# EasyEDA Pro project zhuban.epro, schematic Schematic1

## Sheets
1 P1: Board Name: Board1; Create Date: 2025-02-24; Page Name: P1; Project Name: as2月底版; Schematic Name: Schematic1; Update Date: 2025-02-25; Company: 嘉立创EDA; Page Size: A4; Version: V1.0
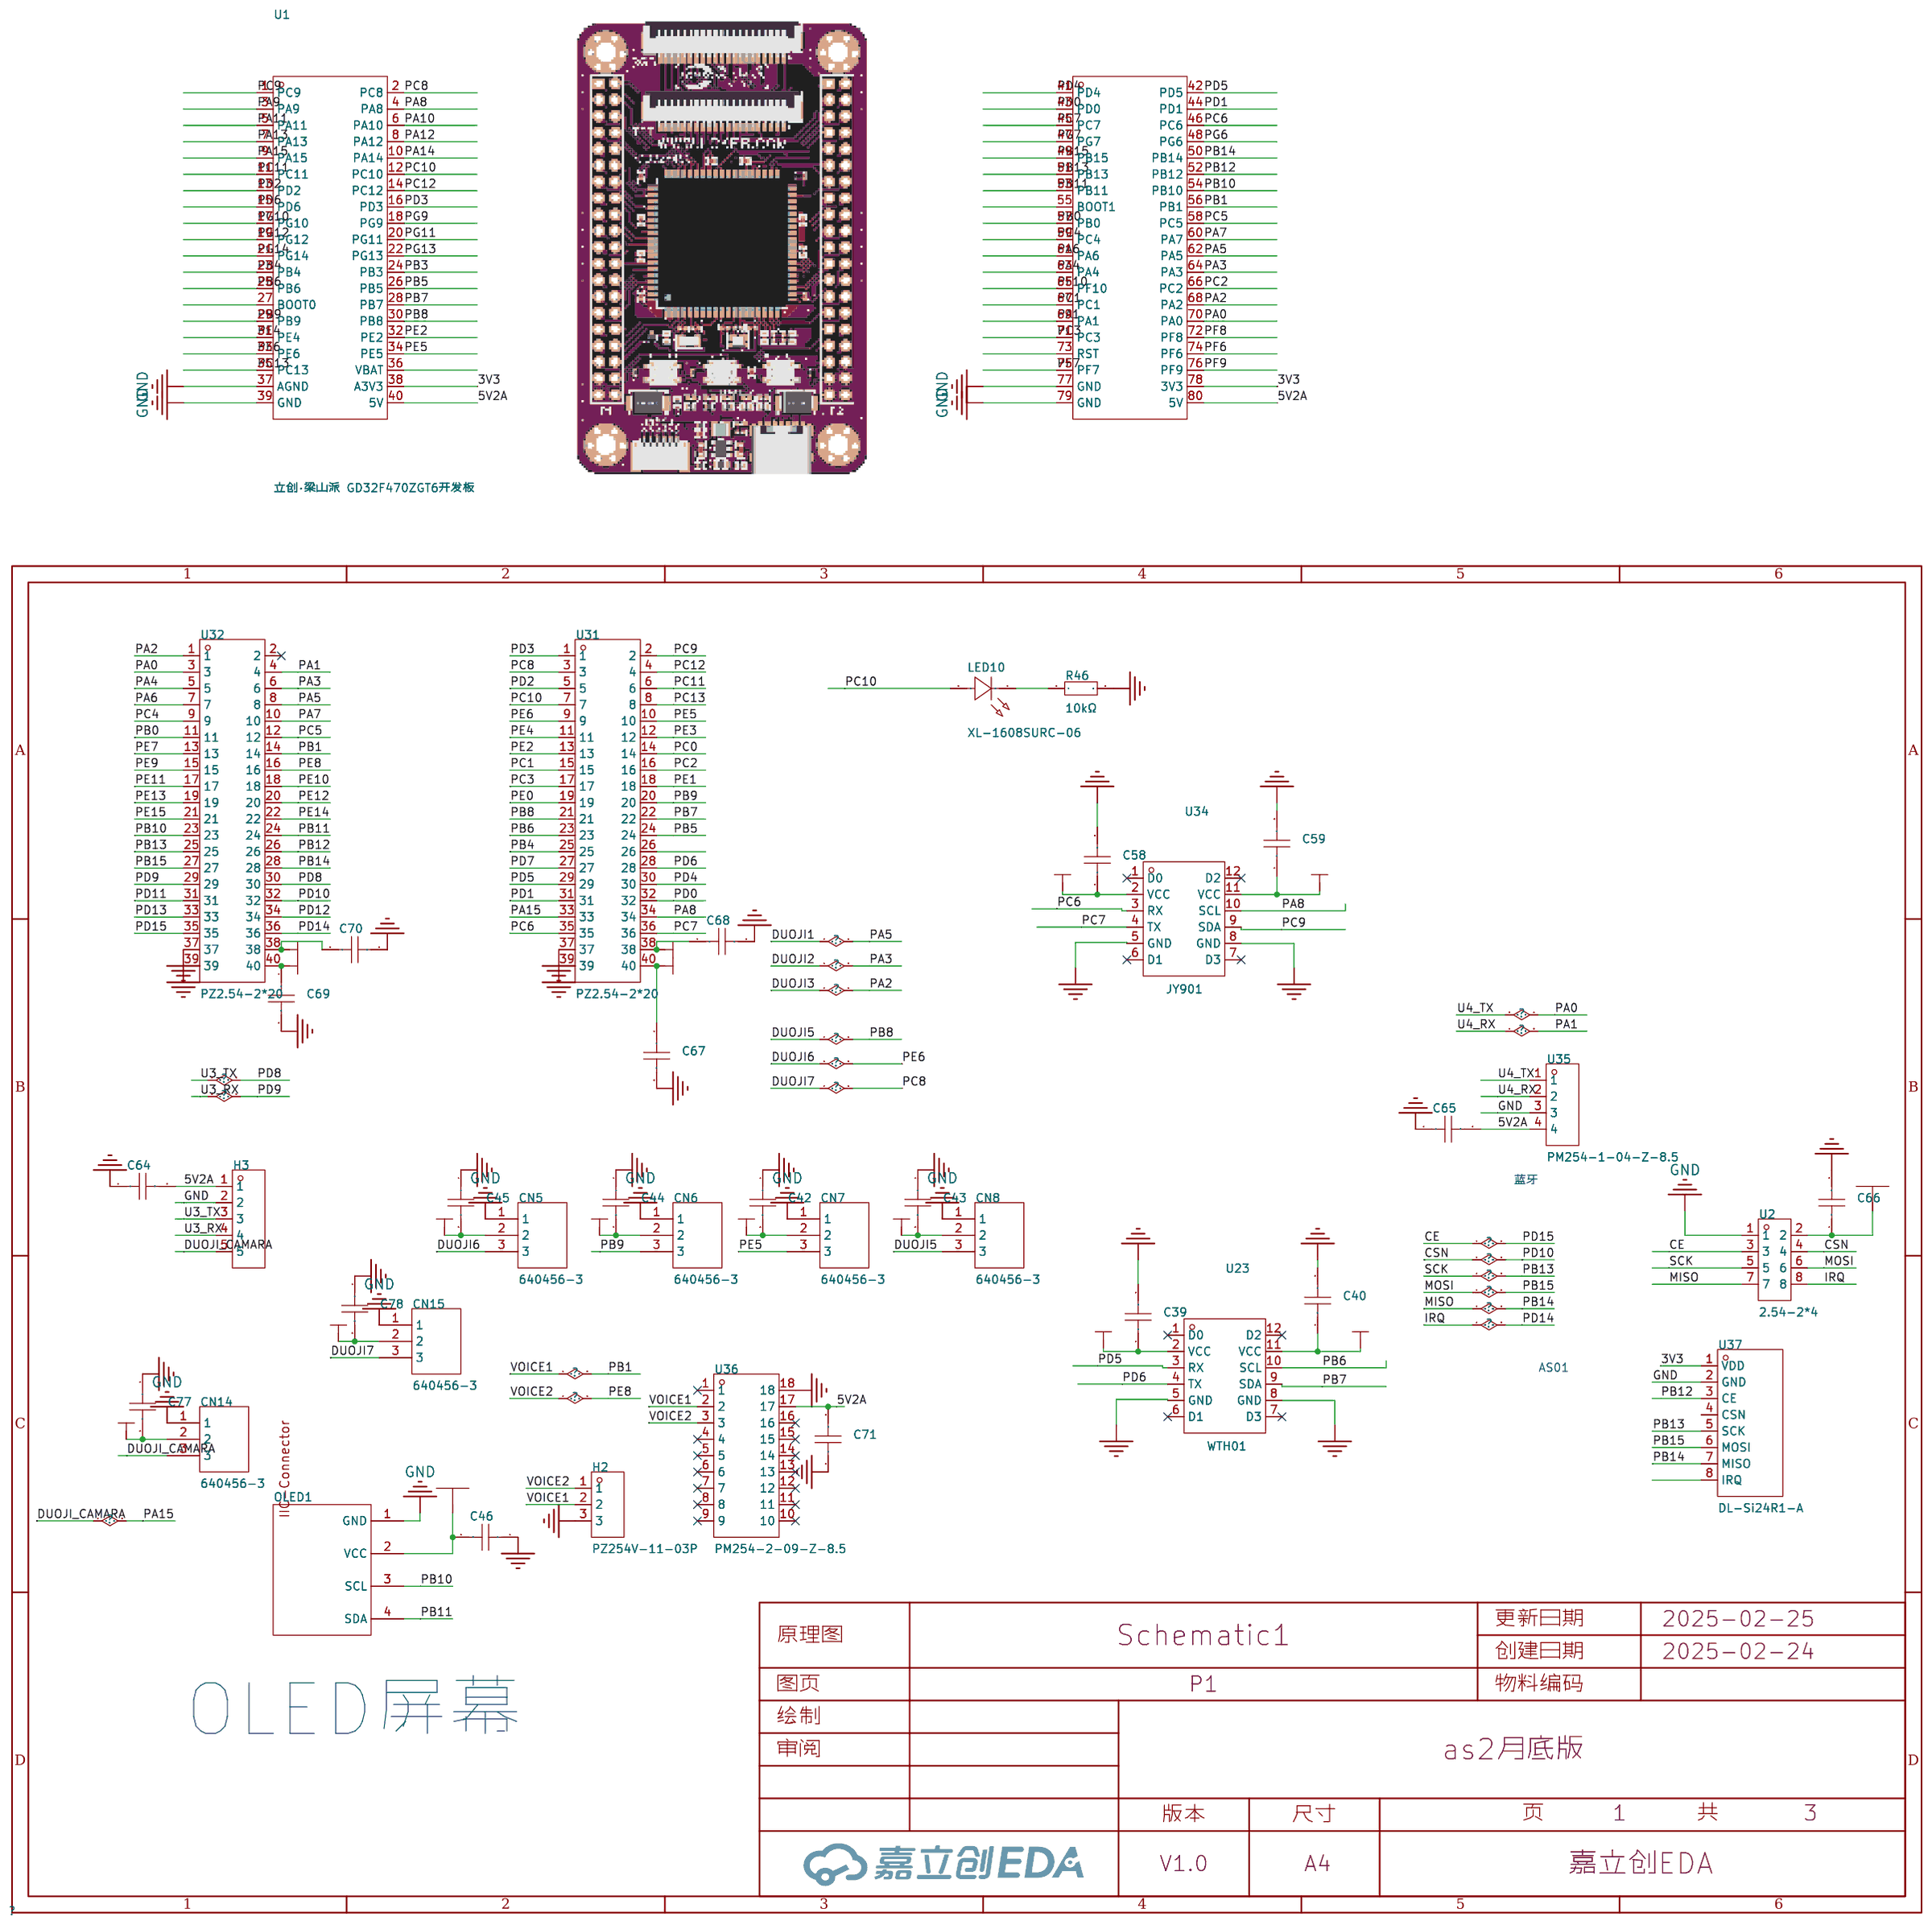
[diagram p0: P1]
2 P2: Page Name: P2; Update Date: 2025-02-24
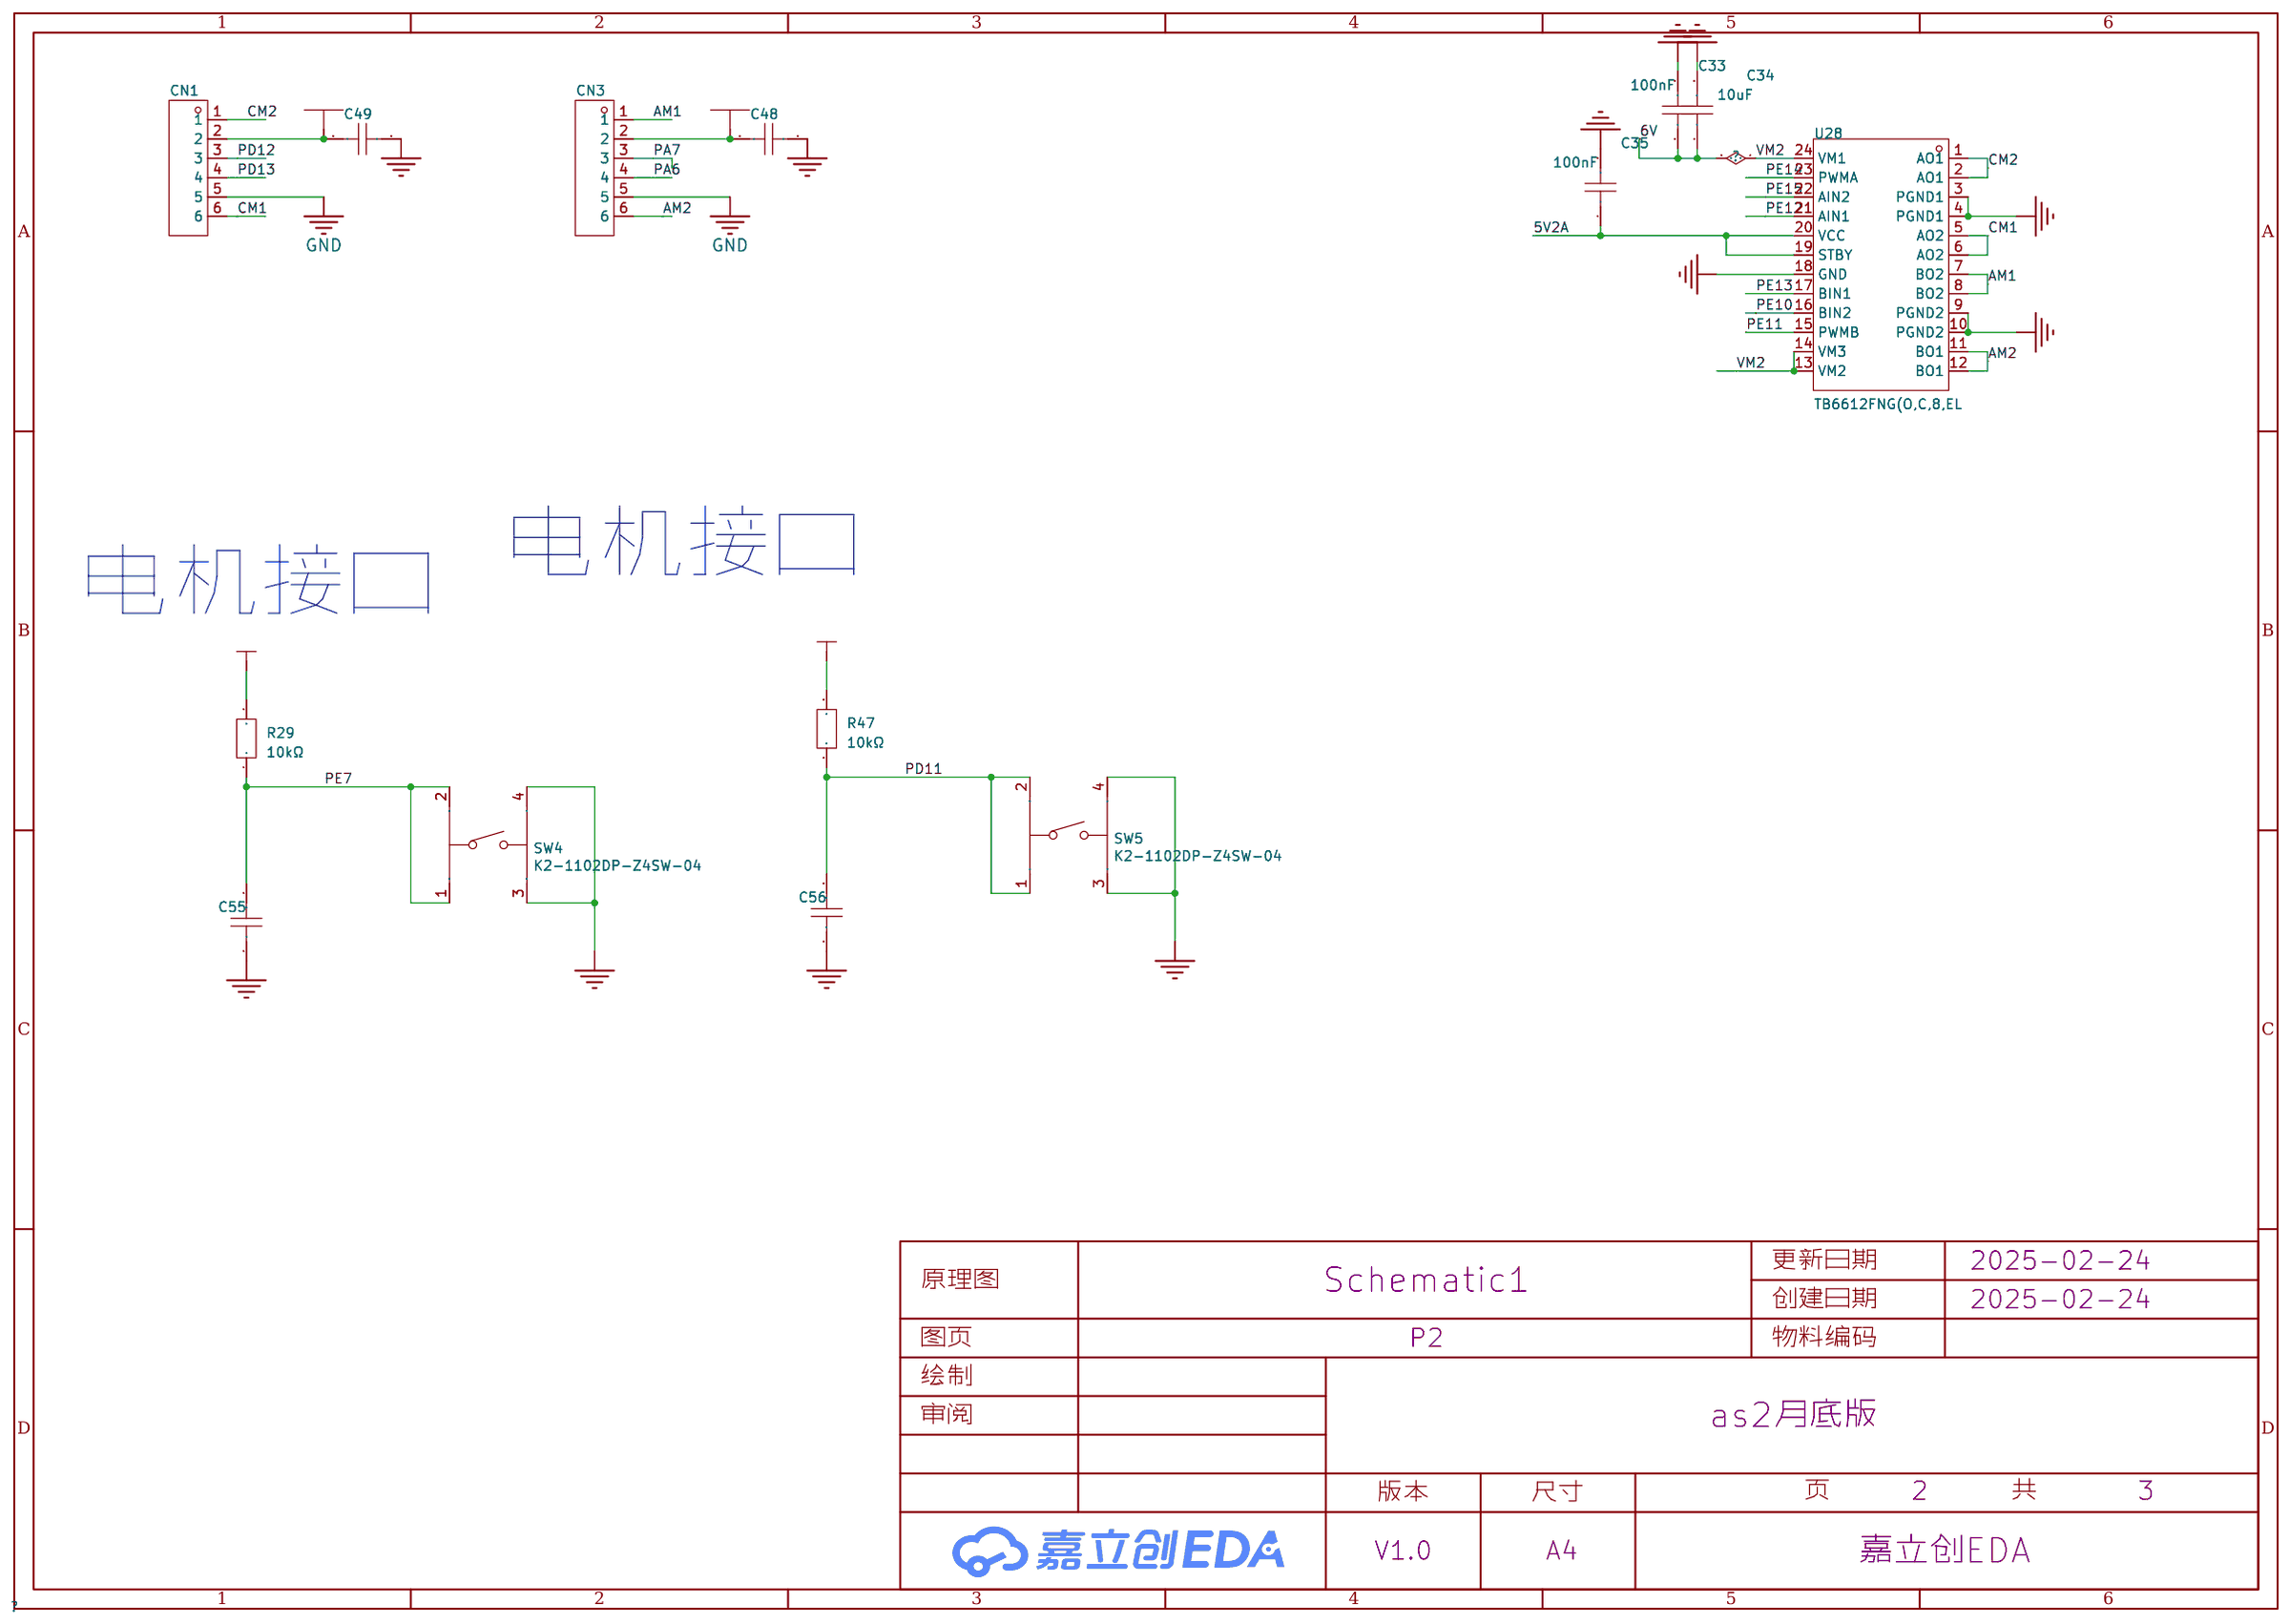
[diagram p1: P2]
3 P3: Page Name: P3; Update Date: 2025-02-24
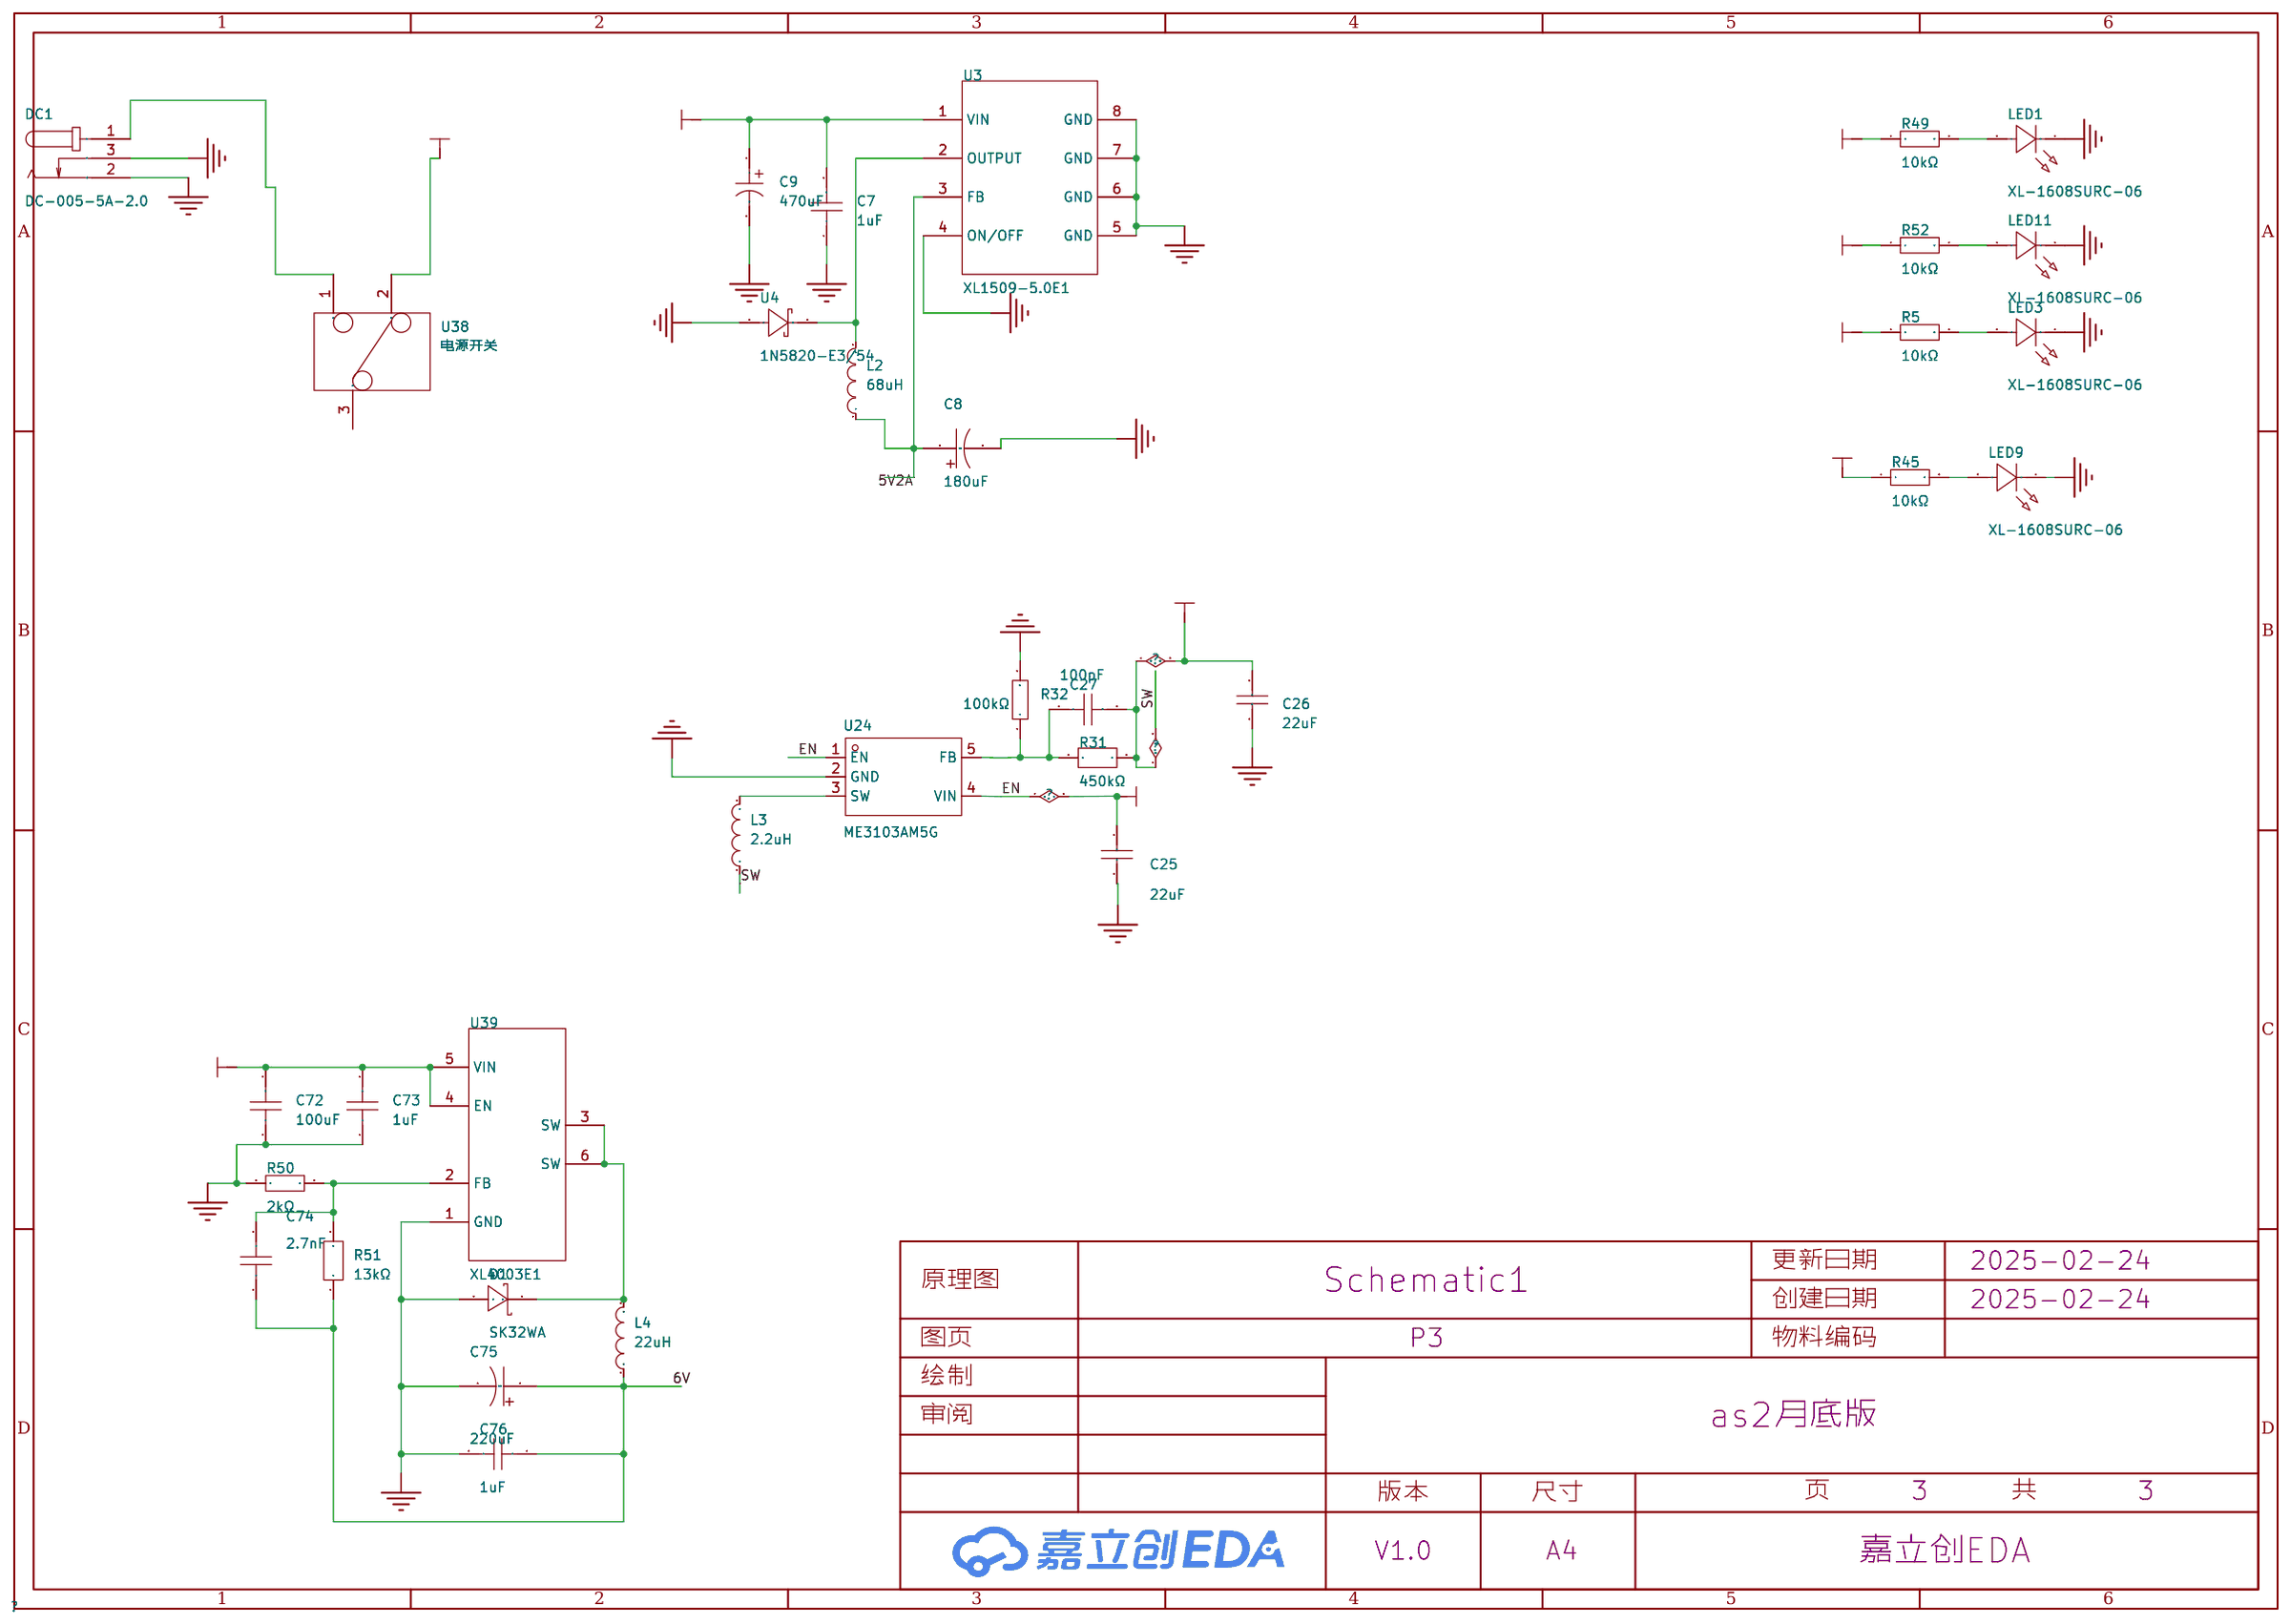
[diagram p2: P3]

## Parts
sheet P1
C39  100nF  [C0603]
C40  100nF  [C0603]
C42  100nF  [C0603]
C43  100nF  [C0603]
C44  100nF  [C0603]
C45  100nF  [C0603]
C46  100nF  [C0603]
C58  100nF  [C0603]
C59  100nF  [C0603]
C64  100nF  [C0603]
C65  100nF  [C0603]
C66  100nF  [C0603]
C67  100nF  [C0603]
C68  100nF  [C0603]
C69  100nF  [C0603]
C70  100nF  [C0603]
C71  100nF  [C0603]
C77  100nF  [C0603]
C78  100nF  [C0603]
CN5  640456-3  [CONN-TH_640456-3]
CN6  640456-3  [CONN-TH_640456-3]
CN7  640456-3  [CONN-TH_640456-3]
CN8  640456-3  [CONN-TH_640456-3]
CN14  640456-3  [CONN-TH_640456-3]
CN15  640456-3  [CONN-TH_640456-3]
H2  PZ254V-11-03P  [HDR-TH_3P-P2.54-V-M]
H3  PZ254V-11-05P  [HDR-TH_5P-P2.54-V-M]
LED10  XL-1608SURC-06  [LED0603-RD_RED]
OLED1  -  [0.96OLED_4P]
R46  10kΩ  [R0603]
U1  立创·梁山派 GD32F470ZGT6开发板  [DIP-80_L45-W69.97-P2.54X2-LS35.9]
U2  2.54-2*4  [HDR-TH_8P-P2.54-V-F-R2-C4-S2.54]
U23  WTH01  [JY901]
U31  PZ2.54-2*20  [HDR-TH_40P-P2.54-V-M-R2-C20-S2.54]
U32  PZ2.54-2*20  [HDR-TH_40P-P2.54-V-M-R2-C20-S2.54]
U34  JY901  [JY901]
U35  PM254-1-04-Z-8.5  [HDR-TH_4P-P2.54-V-F]
U36  PM254-2-09-Z-8.5  [HDR-TH_18P-P2.54-V-F-R2-C9-S2.54]
U37  DL-Si24R1-A  [WIRELM-SMD_DL-SI24R1-A]
sheet P2
C33  100nF  [C0603]
C34  10uF  [C0603]
C35  100nF  [C0603]
C48  100nF  [C0603]
C49  100nF  [C0603]
C55  100nF  [C0603]
C56  100nF  [C0603]
CN1  PH2.0-6P  [PH2.0-6P 直针端子座]
CN3  PH2.0-6P  [PH2.0-6P 直针端子座]
R29  10kΩ  [R0603]
R47  10kΩ  [R0603]
SW4  K2-1102DP-Z4SW-04  [SW-TH_4P-L6.0-W6.0-P4.50-LS6.5]
SW5  K2-1102DP-Z4SW-04  [SW-TH_4P-L6.0-W6.0-P4.50-LS6.5]
U28  TB6612FNG(O,C,8,EL  [SSOP-24_L8.4-W5.8-P0.65-LS7.8-BL]
sheet P3
C7  1uF  [C0603]
C8  180uF  [CAP-TH_BD8.0-P3.50-D0.6-FD]
C9  470uF  [CAP-TH_BD8.0-P3.50-D0.6-FD_1]
C25  22uF  [C1206]
C26  22uF  [C1206]
C27  100pF  [C0603]
C72  100uF  [C1206]
C73  1uF  [C0603]
C74  2.7nF  [C0603]
C75  220uF  [CAP-SMD_BD6.3-L6.6-W6.6-LS7.2-FD]
C76  1uF  [C0603]
D1  SK32WA  [SOD-123F_L2.8-W1.8-LS3.7-RD]
DC1  DC-005-5A-2.0  [DC-IN-TH_DC-005-5A-2.0]
L2  68uH  [IND-SMD_L7.1-W6.6-1]
L3  2.2uH  [IND-SMD_L2.5-W2.0_MHCD252012A]
L4  22uH  [IND-SMD_L7.0-W6.6_FXL0650]
LED1  XL-1608SURC-06  [LED0603-RD_RED]
LED3  XL-1608SURC-06  [LED0603-RD_RED]
LED9  XL-1608SURC-06  [LED0603-RD_RED]
LED11  XL-1608SURC-06  [LED0603-RD_RED]
R5  10kΩ  [R0603]
R31  450kΩ  [R0402]
R32  100kΩ  [R0603]
R45  10kΩ  [R0603]
R49  10kΩ  [R0603]
R50  2kΩ  [R0603]
R51  13kΩ  [R0603]
R52  10kΩ  [R0603]
U3  XL1509-5.0E1  [SOIC-8_L5.0-W4.0-P1.27-LS6.0-BL]
U4  1N5820-E3/54  [DO-201AD_BD5.3-L8.4-P12.50-D1.4-FD]
U24  ME3103AM5G  [SOT-23-5_L3.0-W1.7-P0.95-LS2.8-BR]
U38  电源开关  [电源开关]
U39  XL4003E1  [TO-252-5_L6.5-W5.6-P1.27-LS9.5-TL]

## Library data of the parts
C39 C40 C42-C46 C48 C49 C55 C56 C58 C59 C64-C71 C77 C78 = CC0603KRX7R9BB104: 容值:100nF;精度:±10%;额定电压:50V;材质(温度系数):X7R;; LCSC Part Name: 100nF ±10% 50V; Supplier Part: C14663; Manufacturer: YAGEO(国巨); Supplier Footprint: 0603; JLCPCB Part Class: 基础库; Datasheet: https://atta.szlcsc.com/upload/public/pdf/source/20180910/C282072_33301C7F631E79921B82A8DAC6BCC5B3.pdf; Supplier: LCSC; Tolerance: ±10%; Voltage Rated: 50V; Temperature Coefficient: X7R
CN5-CN8 CN14 CN15 = 640456-3: 插针结构:1x3P;间距:2.54mm;安装方式:-;参考系列:-;总PIN数:3P;排数:1;每排PIN数:3;行距:-;触头材质:铜合金;; LCSC Part Name: 间距:2.54mm 1x3P; Supplier Part: C86503; Manufacturer: TE Connectivity(泰科电子); Supplier Footprint: 插件,P=2.54mm; JLCPCB Part Class: 扩展库; Datasheet: https://atta.szlcsc.com/upload/public/pdf/source/20181127/C305753_3483FB8925186ACF8DDBCF4A8DBEDF25.pdf; Supplier: LCSC; Pins Structure: 1x3P; Pitch: 2.54mm; Number of Pins: 3P; Number of Rows: 1; Number of PINs Per Row: 3; Contact Material: 铜合金
H2 = PZ254V-11-03P: 插针结构:1x3P;间距:2.54mm;行距:-;圆针/方针:方针;安装类型:直插;排数:单排;总PIN位数:3P;额定电流:3A;额定电压:250V;配合针长度:6mm;塑高:2.5mm;端接针长度:3mm;工作温度范围:-40℃~+105℃;颜色:黑色;; LCSC Part Name: 间距:2.54mm 1x3P 直插 方针; Supplier Part: C2937625; Manufacturer: XFCN(兴飞); Supplier Footprint: 插件,P=2.54mm; JLCPCB Part Class: 扩展库; Datasheet: https://atta.szlcsc.com/upload/public/pdf/source/20200309/C492402_8335C3D49C4E4C618838D59BB1D024C1.pdf; Supplier: LCSC; Pin Structure: 1x3P; Pitch: 2.54mm; Circluar Pins/Square Pins: 方针; Mounting Type: 直插; Number of Rows: 单排; Number of Pins: 3P; Current Rating (Max): 3A; Voltage Rating (Max): 250V; Length of Mating Pin: 6mm; Insulation Height: 2.5mm; Length of End Connection Pin: 3mm; Operating Temperature Range: -40℃~+105℃; Color: 黑色
H3 = PZ254V-11-05P: 插针结构:1x5P;间距:2.54mm;行距:-;圆针/方针:方针;安装类型:直插;排数:单排;总PIN位数:5P;额定电流:-;额定电压:-;配合针长度:6mm;塑高:2.5mm;端接针长度:3mm;触头材质:黄铜;触头镀层:-;工作温度范围:-40℃~+105℃;颜色:黑色;; LCSC Part Name: 间距:2.54mm 1x5P 直插 方针; Supplier Part: C492404; Manufacturer: XFCN(兴飞); Supplier Footprint: 插件,P=2.54mm; JLCPCB Part Class: 扩展库; Datasheet: https://atta.szlcsc.com/upload/public/pdf/source/20200309/C492404_E51533260F8710EFF5D4617281164C1D.pdf; Supplier: LCSC; Pin Structure: 1x5P; Pitch: 2.54mm; Circluar Pins/Square Pins: 方针; Mounting Type: 直插; Number of Rows: 单排; Number of Pins: 5P; Length of Mating Pin: 6mm; Insulation Height: 2.5mm; Length of End Connection Pin: 3mm; Contact Material: 黄铜; Operating Temperature Range: -40℃~+105℃; Color: 黑色
LED1 LED3 LED9-LED11 = XL-1608SURC-06: 发光颜色:红色;功率:55mW;正向电流:25mA;主波长:617nm~621nm;透镜颜色:无色透明透镜;色温:-;发光角度:120°;载带方式:正贴;工作温度:-30℃~+85℃;; Supplier Part: C965799; Manufacturer: XINGLIGHT(成兴光); Supplier Footprint: 0603; JLCPCB Part Class: 扩展库; Datasheet: https://atta.szlcsc.com/upload/public/pdf/source/20221102/D860AFDD1CDB02C5A8064103A32707E2.pdf; Supplier: LCSC; Emitted Color: 红色; Power Dissipation: 55mW; Forward Current: 25mA; Dominant Wavelength: 617nm~621nm; Peak Wavelength: 623nm; Lens Color: 无色透明透镜; Viewing Angle: 120°; Mounting Sytle: 正贴; Operating Temperature: -30℃~+85℃
OLED1 = 0.96OLED_4P: LCSC Part Name: 0.96OLED_4P_MODULE_JX; Supplier Part: C9900004566; Manufacturer Part: 0.96OLED_4P_MODULE_JX; Supplier Footprint: THrough hole; JLCPCB Part Class: Extended Part; Supplier: LCSC
R5 R45 R46 R49 R52 = 0603WAF1002T5E: 电阻类型:厚膜电阻;阻值:10kΩ;精度:±1%;功率:100mW;最大工作电压:75V;温度系数:±100ppm/℃;; LCSC Part Name: 厚膜电阻 10kΩ ±1% 100mW; Supplier Part: C25804; Manufacturer: UNI-ROYAL(厚声); Supplier Footprint: 0603; JLCPCB Part Class: Basic Part; Datasheet: https://atta.szlcsc.com/upload/public/pdf/source/20200306/C422600_1E6D84923E4A46A82E41ADD87F860B5C.pdf; Supplier: LCSC; Type: 厚膜电阻; Tolerance: ±1%; Power(Watts): 100mW; Overload Voltage (Max): 75V; Temperature Coefficient: ±100ppm/℃; Operating Temperature Range: -55℃~+155℃
U1 = 立创·梁山派 GD32F470ZGT6开发板: 立创·梁山派开发板是基于GD32F470ZGT6 全国产化开源开发板，资源接口丰富，完善的配套视频教程、文档教程、实验案例。提供在线编译器，10分钟快速入门。开源设计，非常适合新手入门与项目方案评估。; LCSC Part Name: 立创·梁山派 GD32F470ZGT6开发板 六件套; Supplier Part: C5162177; Manufacturer: 立创开发板; JLCPCB Part Class: Extended Part; Datasheet: https://atta.szlcsc.com/upload/public/pdf/source/20230213/6B1DB78304135B42B965394F965429D1.pdf; Supplier: LCSC
U2 = 2.54-2*4: 插孔结构:2x4P;间距:2.54mm;行距:2.54mm;圆孔/方孔:方孔;安装类型:直插;排数:双排;总孔位数:8P;额定电流:2.5A;额定电压:-;插孔方向:顶部;塑高:8.5mm;工作温度范围:-40℃~+105℃;; LCSC Part Name: 间距:2.54mm 2x4P 直插; Supplier Part: C2977588; Manufacturer: ZHOURI(洲日); Supplier Footprint: 插件,P=2.54mm; JLCPCB Part Class: 扩展库; Datasheet: https://atta.szlcsc.com/upload/public/pdf/source/20220328/363EB391BC0EB759CF231FC910753CBE.pdf; Supplier: LCSC; Holes Structure: 2x4P; Pitch: 2.54mm; Row Spacing: 2.54mm; Circular Hole / Square Hole: 方孔; Mounting Type: 直插; Number of Rows: 双排; Number of Holes: 8P; Current Rating (Max): 2.5A; Holes Direction: 顶部; Insulation Height: 8.5mm; Operating Temperature Range: -40℃~+105℃
U23 U34 = JY901: _: 3
U31 U32 = PZ2.54-2*20: 插针结构:2x20P;间距:2.54mm;安装类型:直插;排数:双排;总PIN位数:40P;触头镀层:金;; Supplier Part: C5224014; Manufacturer: ZHOURI(洲日); Supplier Footprint: 插件,P=2.54mm; JLCPCB Part Class: Extended Part; Datasheet: https://atta.szlcsc.com/upload/public/pdf/source/20221102/7E8316C38DB6D81BB18273F4CFF8B2F6.pdf; Supplier: LCSC; Pin Structure: 2x20P; Pitch: 2.54mm; Mounting Type: 直插; Number of Rows: 双排; Number of Pins: 40P; Contact Plating: 金
U35 = PM254-1-04-Z-8.5_C2897367: 插孔结构:1x4P;间距:2.54mm;行距:-;圆孔/方孔:方孔;安装类型:直插;排数:单排;总孔位数:4P;额定电流:3A;额定电压:-;插孔方向:顶部;塑高:8.5mm;触头材质:铜合金;工作温度范围:-40℃~+105℃;焊接温度(最大值):260℃@5S;; LCSC Part Name: 1x4P 间距:2.54mm 直插; Supplier Part: C2897367; Manufacturer: HCTL(华灿天禄); Supplier Footprint: 插件,P=2.54mm; JLCPCB Part Class: 扩展库; Datasheet: https://atta.szlcsc.com/upload/public/pdf/source/20230609/534BE42964C679BDE98E061007C4ABD6.pdf; Supplier: LCSC; Holes Structure: 1x4P; Pitch: 2.54mm; Circular Hole / Square Hole: 方孔; Mounting Type: 直插; Number of Rows: 单排; Number of Holes: 4P; Current Rating (Max): 3A; Holes Direction: 顶部; Insulation Height: 8.5mm; Contact Material: 铜合金; Operating Temperature Range: -40℃~+105℃; Soldering Temperature(Max): 260℃@5S
U36 = PM254-2-09-Z-8.5: 插孔结构:2x9P;间距:2.54mm;行距:2.54mm;圆孔/方孔:方孔;安装类型:直插;排数:双排;总孔位数:18P;额定电流:3A;额定电压:-;插孔方向:顶部;塑高:8.5mm;触头材质:铜合金;工作温度范围:-40℃~+105℃;焊接温度(最大值):260℃@5S;; LCSC Part Name: 2x9P 间距:2.54mm 直插; Supplier Part: C2897410; Manufacturer: HCTL(华灿天禄); Supplier Footprint: 插件,P=2.54mm; JLCPCB Part Class: 扩展库; Datasheet: https://atta.szlcsc.com/upload/public/pdf/source/20230609/3D36CA2C1BFC9FD1C3F709AD9DFEB9C2.pdf; Supplier: LCSC; Holes Structure: 2x9P; Pitch: 2.54mm; Row Spacing: 2.54mm; Circular Hole / Square Hole: 方孔; Mounting Type: 直插; Number of Rows: 双排; Number of Holes: 18P; Current Rating (Max): 3A; Holes Direction: 顶部; Insulation Height: 8.5mm; Contact Material: 铜合金; Operating Temperature Range: -40℃~+105℃; Soldering Temperature(Max): 260℃@5S
U37 = DL-Si24R1-A: 2.4G模块,双向收发模块,接收发射一体,Si24R1无线射频模块,抗干扰性能强,高灵敏度,空旷距离100米,应用于无线玩具、智能家居、遥控器等; LCSC Part Name: 无线模块; Supplier Part: C2894788; Manufacturer: DreamLNK(骏晔科技); JLCPCB Part Class: 扩展库; Datasheet: https://atta.szlcsc.com/upload/public/pdf/source/20210908/5A84483BBA38357A9B2709D354861C79.pdf; Supplier: LCSC
C33 C35 = CGA0603X7R104K500JT: 容值:100nF;精度:±10%;额定电压:50V;材质(温度系数):X7R;; LCSC Part Name: 100nF ±10% 50V; Supplier Part: C6119867; Manufacturer: HRE(芯声); Supplier Footprint: 0603; JLCPCB Part Class: 扩展库; Supplier: LCSC; Tolerance: ±10%; Voltage Rated: 50V; Temperature Coefficient: X7R
C34 = CGA0603X5R106K100JT: 容值:10uF;精度:±10%;额定电压:10V;材质(温度系数):X5R;; LCSC Part Name: 10uF ±10% 10V; Supplier Part: C6119842; Manufacturer: HRE(芯声); Supplier Footprint: 0603; JLCPCB Part Class: Extended Part; Supplier: LCSC; Tolerance: ±10%; Voltage Rated: 10V; Temperature Coefficient: X5R
CN1 CN3 = PH2.0-6P: Pin Type: IN; Supplier: LCSC; Supplier Part: C722763; Manufacturer: CAX(创都); Manufacturer Part: PH2.0-4P; JLCPCB Part Class: Extended Part
R29 R47 = FRC0603J103TS: 电阻类型:厚膜电阻;阻值:10kΩ;精度:±5%;功率:100mW;最大工作电压:75V;温度系数:±100ppm/℃;; LCSC Part Name: 10kΩ ±5% 100mW 厚膜电阻; Supplier Part: C2930027; Manufacturer: FOJAN(富捷); Supplier Footprint: 0603; JLCPCB Part Class: 扩展库; Datasheet: https://atta.szlcsc.com/upload/public/pdf/source/20211221/925EC7D7225764EE0046F22065062C87.pdf; Supplier: LCSC; Type: 厚膜电阻; Tolerance: ±5%; Power(Watts): 100mW; Overload Voltage (Max): 75V; Temperature Coefficient: ±100ppm/℃; Operating Temperature Range: -55℃~+155℃
SW4 SW5 = K2-1102DP-Z4SW-04: Supplier: LCSC; Supplier Part: C194449; Manufacturer: 韩国韩荣; JLCPCB Part Class: Extended Part
U28 = TB6612FNG(O,C,8,EL: 双直流电机驱动器集成电路; Supplier Part: C88224; Manufacturer: TOSHIBA(东芝); Supplier Footprint: SSOP-24-208mil; JLCPCB Part Class: 扩展库; Datasheet: https://atta.szlcsc.com/upload/public/pdf/source/20171128/C141517_15118625624231147036.pdf; Supplier: LCSC
C7 = CGA0603X5R105K160JT: 容值:1uF;精度:±10%;额定电压:16V;材质(温度系数):X5R;; LCSC Part Name: 1uF ±10% 16V; Supplier Part: C6119849; Manufacturer: HRE(芯声); Supplier Footprint: 0603; JLCPCB Part Class: 扩展库; Supplier: LCSC; Tolerance: ±10%; Voltage Rated: 16V; Temperature Coefficient: X5R
C8 = LKMD0901V181MF: 容值:180uF;精度:±20%;额定电压:35V;纹波电流:900mA@100kHz;等效串联电阻:210mΩ@100kHz;; LCSC Part Name: 180uF ±20% 35V; Supplier Part: C442870; Manufacturer: Ymin(永铭); Supplier Footprint: 插件,D8xL9mm; JLCPCB Part Class: 扩展库; Datasheet: https://atta.szlcsc.com/upload/public/pdf/source/20200220/C487520_443A40905984A455D375EE990FEAA9E8.pdf; Supplier: LCSC; Tolerance: ±20%; Rated Voltage: 35V; Ripple Current: 900mA@100kHz; Equivalent Series Resistance(ESR): 210mΩ@100kHz; Lead Spacing: 3.5mm; φD: 8mm; L: 9mm; Lifetime @ Temp: 10000hrs@105℃
C9 = CD2884771EM0812VFL: 容值:470uF;额定电压:25V;; LCSC Part Name: 470uF 25V; Supplier Part: C2960233; Manufacturer: HRK(鸿瑞凯电子); Supplier Footprint: 插件,D8xL12mm; JLCPCB Part Class: 扩展库; Datasheet: https://atta.szlcsc.com/upload/public/pdf/source/20240703/D49961C1CEC6E325964F7113D69E9087.pdf; Supplier: LCSC; Rated Voltage: 25V; φD: 8mm; L: 12mm; Operating Temperature: -40℃~+105℃
C25 C26 = CL31A226KAHNNNE: 容值:22uF;精度:±10%;额定电压:25V;材质(温度系数):X5R;; LCSC Part Name: 22uF ±10% 25V; Supplier Part: C12891; Manufacturer: SAMSUNG(三星); Supplier Footprint: 1206; JLCPCB Part Class: 基础库; Datasheet: https://atta.szlcsc.com/upload/public/pdf/source/20160218/1457707763339.pdf; Supplier: LCSC; Tolerance: ±10%; Voltage Rated: 25V; Temperature Coefficient: X5R
C27 = CC0603JRNPO9BN101: 容值:100pF;精度:±5%;额定电压:50V;材质(温度系数):NP0;; LCSC Part Name: 100pF ±5% 50V; Supplier Part: C14665; Manufacturer: YAGEO(国巨); Supplier Footprint: 0603; JLCPCB Part Class: 扩展库; Datasheet: https://atta.szlcsc.com/upload/public/pdf/source/20181008/C309499_21CC21451B82C39E3D92150FD6B30293.pdf; Supplier: LCSC; Tolerance: ±5%; Voltage Rated: 50V; Temperature Coefficient: NP0
C72 = HGC1206R5107M100NSPJ: 容值:100uF;精度:±20%;额定电压:10V;材质(温度系数):X5R;; LCSC Part Name: 100uF ±20% 10V; Supplier Part: C7432784; Manufacturer: Chinocera(华瓷); Supplier Footprint: 1206; JLCPCB Part Class: 扩展库; Datasheet: https://atta.szlcsc.com/upload/public/pdf/source/20240320/FAC3FEC40A78BC5CCCE96C232A94D860.pdf; Supplier: LCSC; Tolerance: ±20%; Voltage Rated: 10V; Temperature Coefficient: X5R
C73 C76 = CGA0603X5R105K500JT: 容值:1uF;精度:±10%;额定电压:50V;材质(温度系数):X5R;; LCSC Part Name: 1uF ±10% 50V; Supplier Part: C6119852; Manufacturer: HRE(芯声); Supplier Footprint: 0603; JLCPCB Part Class: 扩展库; Supplier: LCSC; Tolerance: ±10%; Voltage Rated: 50V; Temperature Coefficient: X5R
C74 = GCM188R71H272KA37D: 容值:2.7nF;精度:±10%;额定电压:50V;材质(温度系数):X7R;; LCSC Part Name: 2.7nF ±10% 50V; Supplier Part: C363931; Manufacturer: muRata(村田); Supplier Footprint: 0603; JLCPCB Part Class: 扩展库; Datasheet: https://atta.szlcsc.com/upload/public/pdf/source/20200305/C490387_23319AE8C154DEB24C505E6C82A8106A.pdf; Supplier: LCSC; Tolerance: ±10%; Voltage Rated: 50V; Temperature Coefficient: X7R
C75 = RVT1C221M0605: 容值:220uF;精度:±20%;额定电压:16V;纹波电流:95mA@122Hz;; LCSC Part Name: 220uF ±20% 16V; Supplier Part: C2977551; Manufacturer: ROQANG(容强); Supplier Footprint: SMD,D6.3xL5.4mm; JLCPCB Part Class: 扩展库; Datasheet: https://atta.szlcsc.com/upload/public/pdf/source/20220223/DD822675CC1DF2F0C06D5C2255C9C2D9.pdf; Supplier: LCSC; Tolerance: ±20%; Rated Voltage: 16V; Ripple Current: 95mA@122Hz; φD: 6.3mm; L: 5.4mm; Lifetime @ Temp: 2000hrs@105℃; Operating Temperature: -40℃~+105℃
D1 = SK32WA: 二极管配置:独立式;正向压降(Vf):550mV@3A;直流反向耐压(Vr):20V;平均整流电流(Io):3A;; LCSC Part Name: 电压:20V 电流:3A; Supplier Part: C183472; Manufacturer: SHIKUES(时科); Supplier Footprint: SOD-123F; JLCPCB Part Class: 扩展库; Datasheet: https://atta.szlcsc.com/upload/public/pdf/source/20180323/DA73144C84EC669030D5D10416970BB4.pdf; Supplier: LCSC; Diode Configuration: 独立式; Forward Voltage (Vf@If): 550mV@3A; Reverse Voltage (Vr): 20V; Average Rectified Current (Io): 3A; Reverse Leakage Current (Ir): 500uA@20V
DC1 = DC-005-5A-2.0: 连接器类型:DC电源插座;安装方式:弯插;触点内径:2mm;触点外径:6.2mm;额定电流:5A;额定电压:24V;工作温度范围:-20℃~+70℃;; LCSC Part Name: DC电源插座 内径:2mm 外径:6.2mm; Supplier Part: C381116; Manufacturer: XKB Connection(中国星坤); Supplier Footprint: 插件; JLCPCB Part Class: 扩展库; Datasheet: https://atta.szlcsc.com/upload/public/pdf/source/20211015/707A35F7AB6E89C57AAB641950105BB7.pdf; Supplier: LCSC; Connector Type: DC电源插座; Mounting Style: 弯插; Inside Contact Diameter: 2mm; Outside Contact Diameter: 6.2mm; Current Rating (Max): 5A; Voltage Rating (Max): 24V; Operating Temperature Range: -20℃~+70℃
L2 = PSPMAA0605H-680M-IGF: 电感值:68uH;精度:±20%;额定电流:2A;饱和电流(Isat):2.5A;; LCSC Part Name: 68uH ±20% 2.5A; Supplier Part: C2983094; Manufacturer: PROD(谱罗德); Supplier Footprint: SMD,6.6x7.1mm; JLCPCB Part Class: 扩展库; Datasheet: https://atta.szlcsc.com/upload/public/pdf/source/20220421/FA7B36985F5EDDBED7850D2E38F6BF27.pdf; Supplier: LCSC; Tolerance: ±20%; Rated Current: 2A; Saturation Current (Isat): 2.5A; DC Resistance (DCR): 256mΩ; Ratings: AEC-Q200
L3 = BDCD002520102R2MS1: 电感值:2.2uH;精度:±20%;额定电流:1.4A;饱和电流(Isat):2.6A;; LCSC Part Name: 2.2uH ±20% 2.6A; Supplier Part: C2838385; Manufacturer: chilisin(奇力新); Supplier Footprint: 1008; JLCPCB Part Class: 扩展库; Datasheet: https://atta.szlcsc.com/upload/public/pdf/source/20210908/A593167DE07B217A909851FD79DFB804.pdf; Supplier: LCSC; Tolerance: ±20%; Rated Current: 1.4A; Saturation Current (Isat): 2.6A; DC Resistance (DCR): 130mΩ
L4 = FXL0650-220-M: 电感值:22uH;精度:±20%;额定电流:2.6A;饱和电流(Isat):3.5A;类型:一体成型电感;; LCSC Part Name: 22uH ±20% 3.5A; Supplier Part: C475525; Manufacturer: cjiang(长江微电); Supplier Footprint: SMD,6.6x7mm; JLCPCB Part Class: 扩展库; Datasheet: https://atta.szlcsc.com/upload/public/pdf/source/20240426/3189EA8206330E2108542F9E34E540E7.pdf; Supplier: LCSC; Tolerance: ±20%; Rated Current: 2.6A; Saturation Current (Isat): 3.5A; DC Resistance (DCR): 140mΩ; Type: 一体成型电感
R31 = FRC0402F4503TS: 电阻类型:厚膜电阻;阻值:450kΩ;精度:±1%;功率:62.5mW;最大工作电压:50V;温度系数:±100ppm/℃;; LCSC Part Name: 450kΩ ±1% 62.5mW 厚膜电阻; Supplier Part: C5159688; Manufacturer: FOJAN(富捷); Supplier Footprint: 0402; JLCPCB Part Class: 扩展库; Datasheet: https://atta.szlcsc.com/upload/public/pdf/source/20211221/925EC7D7225764EE0046F22065062C87.pdf; Supplier: LCSC; Type: 厚膜电阻; Tolerance: ±1%; Power(Watts): 62.5mW; Overload Voltage (Max): 50V; Temperature Coefficient: ±100ppm/℃
R32 = 0603WAF1003T5E: 电阻类型:厚膜电阻;阻值:100kΩ;精度:±1%;功率:100mW;最大工作电压:75V;温度系数:±100ppm/℃;; LCSC Part Name: 100kΩ ±1% 100mW 厚膜电阻; Supplier Part: C25803; Manufacturer: UNI-ROYAL(厚声); Supplier Footprint: 0603; JLCPCB Part Class: 基础库; Datasheet: https://atta.szlcsc.com/upload/public/pdf/source/20200306/C422600_1E6D84923E4A46A82E41ADD87F860B5C.pdf; Supplier: LCSC; Type: 厚膜电阻; Tolerance: ±1%; Power(Watts): 100mW; Overload Voltage (Max): 75V; Temperature Coefficient: ±100ppm/℃; Operating Temperature Range: -55℃~+155℃
R50 = 0603WAF2001T5E: 电阻类型:厚膜电阻;阻值:2kΩ;精度:±1%;功率:100mW;最大工作电压:75V;温度系数:±100ppm/℃;; LCSC Part Name: 2kΩ ±1% 100mW 厚膜电阻; Supplier Part: C22975; Manufacturer: UNI-ROYAL(厚声); Supplier Footprint: 0603; JLCPCB Part Class: 基础库; Datasheet: https://atta.szlcsc.com/upload/public/pdf/source/20200306/C422600_1E6D84923E4A46A82E41ADD87F860B5C.pdf; Supplier: LCSC; Type: 厚膜电阻; Tolerance: ±1%; Power(Watts): 100mW; Overload Voltage (Max): 75V; Temperature Coefficient: ±100ppm/℃; Operating Temperature Range: -55℃~+155℃
R51 = FRC0603F1302TS: 电阻类型:厚膜电阻;阻值:13kΩ;精度:±1%;功率:100mW;最大工作电压:75V;温度系数:±100ppm/℃;; LCSC Part Name: 13kΩ ±1% 100mW 厚膜电阻; Supplier Part: C2906992; Manufacturer: FOJAN(富捷); Supplier Footprint: 0603; JLCPCB Part Class: 扩展库; Datasheet: https://atta.szlcsc.com/upload/public/pdf/source/20211221/925EC7D7225764EE0046F22065062C87.pdf; Supplier: LCSC; Type: 厚膜电阻; Tolerance: ±1%; Power(Watts): 100mW; Overload Voltage (Max): 75V; Temperature Coefficient: ±100ppm/℃; Operating Temperature Range: -55℃~+155℃
U3 = XL1509-5.0E1: 功能类型:降压型;输入电压:4.5V~40V;输出电流:2A;; LCSC Part Name: 2A 150KHz 40V 降压 DC-DC 转换器; Supplier Part: C61063; Manufacturer: XLSEMI(芯龙); Supplier Footprint: SOIC-8; JLCPCB Part Class: 基础库; Datasheet: https://atta.szlcsc.com/upload/public/pdf/source/20151126/1457707596805.pdf; Supplier: LCSC; Function: 降压型; Input Voltage: 4.5V~40V; Output Current: 2A; Switching Frequency: 150kHz; Operating Temperature: -40℃~+125℃@(TJ); Number of Outputs: 1; Topology: 降压式; Switch tube (built-in/external): 内置
U4 = 1N5820-E3/54: 正向压降(Vf):475mV@3A;直流反向耐压(Vr):20V;整流电流:3A;; LCSC Part Name: 电压:20V 电流:3A; Supplier Part: C5357977; Manufacturer: VISHAY(威世); Supplier Footprint: DO-201AD; JLCPCB Part Class: Extended Part; Datasheet: https://atta.szlcsc.com/upload/public/pdf/source/20231213/4CD9FBE9F25054130E4EF21C8CAD5061.pdf; Supplier: LCSC; Forward Voltage (Vf@If): 475mV@3A; Reverse Voltage (Vr): 20V; Rectified Current: 3A; Reverse Leakage Current (Ir): 2mA@20V
U24 = ME3103AM5G: 功能类型:降压型;输入电压:2.5V~5.5V;输出电压:600mV~5.5V;输出电流(最大值):1A;; Supplier Part: C236734; Manufacturer: MICRONE(南京微盟); Supplier Footprint: SOT-23-5; JLCPCB Part Class: 扩展库; Datasheet: https://atta.szlcsc.com/upload/public/pdf/source/20180709/C236734_1C8BBF9BA334136D9FAF85020467E81B.pdf; Supplier: LCSC; Function: 降压型; Input Voltage: 2.5V~5.5V; Output Voltage: 600mV~5.5V; Output Current (Max): 1A; Switching Frequency: 1.5MHz; Synchronous Rectification: 是; Number of Outputs: 1; Topology: 降压式; Switch tube (built-in/external): 内置
U38 = 电源开关
U39 = XL4003E1: 功能类型:降压型;输出类型:可调;工作电压:5V~32V;输出电压:800mV~30V;输出电流:-;; LCSC Part Name: 4A 300kHz 32V 降压DC-DC转换器; Supplier Part: C55888; Manufacturer: XLSEMI(芯龙); Supplier Footprint: TO-252-5; JLCPCB Part Class: 扩展库; Datasheet: https://atta.szlcsc.com/upload/public/pdf/source/20150915/1457707372750.pdf; Supplier: LCSC; Function: 降压型; Output Type: 可调; Input Voltage: 5V~32V; Output Voltage: 800mV~30V; Switching Frequency: 300kHz; Operating Temperature: -40℃~+125℃; Number of Outputs: 1; Topology: 降压式; Switch tube (built-in/external): 内置

## Nets
3V3: C26.1 C27.2 C66.1 C68.1 C70.1 L3.1 R31.2 R45.1 U1.38(A3V3) U1.78(3V3) U2.2 U31.38 U32.38 U37.1(VDD)
5V2A: C8.1 C25.2 C35.1 C39.1 C40.1 C42.2 C43.2 C44.2 C45.2 C46.2 C48.2 C49.2 C58.1 C59.1 C64.2 C65.2 C67.1 C69.1 C71.2 C77.2 C78.2 CN1.2 CN3.2 CN5.2 CN6.2 CN7.2 CN8.2 CN14.2 CN15.2 H3.1 L2.1 OLED1.2(VCC) R5.1 R29.2 R47.2 U1.40(5V) U1.80(5V) U3.3(FB) U23.2(VCC) U23.11(VCC) U24.1(EN) U24.4(VIN) U28.19(STBY) U28.20(VCC) U31.40 U32.40 U34.2(VCC) U34.11(VCC) U35.4 U36.17
6V: C33.1 C34.1 C74.1 C75.1 C76.1 L4.1 R49.1 R51.1 U28.13(VM2) U28.14(VM3) U28.24(VM1)
12V: C7.2 C9.1 C72.2 C73.2 R52.1 U3.1(VIN) U38.2 U39.4(EN) U39.5(VIN)
GND: C7.1 C8.2 C9.2 C25.1 C26.2 C33.2 C34.2 C35.2 C39.2 C40.2 C42.1 C43.1 C44.1 C45.1 C46.1 C48.1 C49.1 C55.1 C56.1 C58.2 C59.2 C64.1 C65.1 C66.2 C67.2 C68.2 C69.2 C70.2 C71.1 C72.1 C73.1 C75.2 C76.2 C77.1 C78.1 CN1.5 CN3.5 CN5.1 CN6.1 CN7.1 CN8.1 CN14.1 CN15.1 D1.2 DC1.2 DC1.3 H2.3 H3.2 LED1.1(K) LED3.1(K) LED9.1(K) LED11.1(K) OLED1.1(GND) R32.2 R46.2 R50.1 SW4.3 SW4.4 SW5.3 SW5.4 U1.37(AGND) U1.39(GND) U1.77(GND) U1.79(GND) U2.1 U3.4(ON/OFF) U3.5(GND) U3.6(GND) U3.7(GND) U3.8(GND) U4.1(A) U23.5(GND) U23.8(GND) U24.2(GND) U28.3(PGND1) U28.4(PGND1) U28.9(PGND2) U28.10(PGND2) U28.18(GND) U31.37 U31.39 U32.37 U32.39 U34.5(GND) U34.8(GND) U35.3 U36.18 U37.2(GND) U39.1(GND)
AM1: CN3.1 U28.7(BO2) U28.8(BO2)
AM2: CN3.6 U28.11(BO1) U28.12(BO1)
CE: U2.3 U32.35
CM1: CN1.6 U28.5(AO2) U28.6(AO2)
CM2: CN1.1 U28.1(AO1) U28.2(AO1)
CSN: U2.4 U32.32
DUOJI1: U1.62(PA5) U32.8
DUOJI2: U1.64(PA3) U32.6
DUOJI3: U1.68(PA2) U32.1
DUOJI5: CN8.3 U1.30(PB8) U31.21
DUOJI6: CN5.3 U1.33(PE6) U31.9
DUOJI7: CN15.3 U1.2(PC8) U31.3
DUOJI_CAMARA: CN14.3 H3.5 U1.9(PA15) U31.33
IRQ: U2.8 U32.36
MISO: U1.50(PB14) U2.7 U32.28 U37.7(MISO)
MOSI: U1.49(PB15) U2.6 U32.27 U37.6(MOSI)
PA0: U1.70(PA0) U32.3 U35.1
PA1: U1.69(PA1) U32.4 U35.2
PA4: U1.63(PA4) U32.5
PA6: CN3.4 U1.61(PA6) U32.7
PA7: CN3.3 U1.60(PA7) U32.10
PA8: U1.4(PA8) U31.34 U34.10(SCL)
PA9: U1.3(PA9)
PA10: U1.6(PA10)
PA11: U1.5(PA11)
PA12: U1.8(PA12)
PA13: U1.7(PA13)
PA14: U1.10(PA14)
PB0: U1.57(PB0) U32.11
PB1: H2.2 U1.56(PB1) U32.14 U36.2
PB3: U1.24(PB3)
PB4: U1.23(PB4) U31.25
PB5: U1.26(PB5) U31.24
PB6: U1.25(PB6) U23.10(SCL) U31.23
PB7: U1.28(PB7) U23.9(SDA) U31.22
PB9: CN6.3 U1.29(PB9) U31.20
PB10: OLED1.3(SCL) U1.54(PB10) U32.23
PB11: OLED1.4(SDA) U1.53(PB11) U32.24
PB12: U1.52(PB12) U32.26 U37.3(CE)
PB13: U1.51(PB13) U2.5 U32.25 U37.5(SCK)
PC0: U31.14
PC1: U1.67(PC1) U31.15
PC2: U1.66(PC2) U31.16
PC3: U1.71(PC3) U31.17
PC4: U1.59(PC4) U32.9
PC5: U1.58(PC5) U32.12
PC6: U1.46(PC6) U31.35 U34.3(RX)
PC7: U1.45(PC7) U31.36 U34.4(TX)
PC9: U1.1(PC9) U31.2 U34.9(SDA)
PC10: LED10.2(A) U1.12(PC10) U31.7
PC11: U1.11(PC11) U31.6
PC12: U1.14(PC12) U31.4
PC13: U1.35(PC13) U31.8
PD0: U1.43(PD0) U31.32
PD1: U1.44(PD1) U31.31
PD2: U1.13(PD2) U31.5
PD3: U1.16(PD3) U31.1
PD4: U1.41(PD4) U31.30
PD5: U1.42(PD5) U23.3(RX) U31.29
PD6: U1.15(PD6) U23.4(TX) U31.28
PD7: U31.27
PD8: H3.3 U32.30
PD9: H3.4 U32.29
PD11: C56.2 R47.1 SW5.1 SW5.2 U32.31
PD12: CN1.3 U32.34
PD13: CN1.4 U32.33
PE0: U31.19
PE1: U31.18
PE2: U1.32(PE2) U31.13
PE3: U31.12
PE4: U1.31(PE4) U31.11
PE5: CN7.3 U1.34(PE5) U31.10
PE7: C55.2 R29.1 SW4.1 SW4.2 U32.13
PE8: H2.1 U32.16 U36.3
PE9: U32.15
PE10: U28.16(BIN2) U32.18
PE11: U28.15(PWMB) U32.17
PE12: U28.21(AIN1) U32.20
PE13: U28.17(BIN1) U32.19
PE14: U28.23(PWMA) U32.22
PE15: U28.22(AIN2) U32.21
PF6: U1.74(PF6)
PF7: U1.75(PF7)
PF8: U1.72(PF8)
PF9: U1.76(PF9)
PF10: U1.65(PF10)
PG6: U1.48(PG6)
PG7: U1.47(PG7)
PG9: U1.18(PG9)
PG10: U1.17(PG10)
PG11: U1.20(PG11)
PG12: U1.19(PG12)
PG13: U1.22(PG13)
PG14: U1.21(PG14)
$1N8897: LED10.1(K) R46.1
$3N121: DC1.1 U38.1
$3N2924: LED1.2(A) R49.2
$3N3138: LED3.2(A) R5.2
$3N5298: LED9.2(A) R45.2
$3N6658: L2.2 U3.2(OUTPUT) U4.2(C)
$3N19862: C74.2 R50.2 R51.2 U39.2(FB)
$3N20136: D1.1 L4.2 U39.3(SW) U39.6(SW)
$3N21460: LED11.2(A) R52.2
Net-(C27-1): C27.1 R32.1 U24.5(FB)

Not connected (* = marked no-connect by the designer): L3 2; R31 1; U1 27(BOOT0) 36(VBAT) 55(BOOT1) 73(RST); U23 1(D0)* 6(D1)* 7(D3)* 12(D2)*; U24 3(SW); U31 26; U32 2*; U34 1(D0)* 6(D1)* 7(D3)* 12(D2)*; U36 1* 4* 5* 6* 7* 8* 9* 10* 11* 12* 13* 14* 15* 16*; U37 4(CSN) 8(IRQ); U38 3

## Notes on the sheets
sheet 1
- 蓝牙
- AS01
- OLED屏幕
sheet 2
- 电机接口
- 电机接口
